# Altium schematic sheet overview.SchDoc
size A4; SheetNumber: 1; SheetTotal: 2
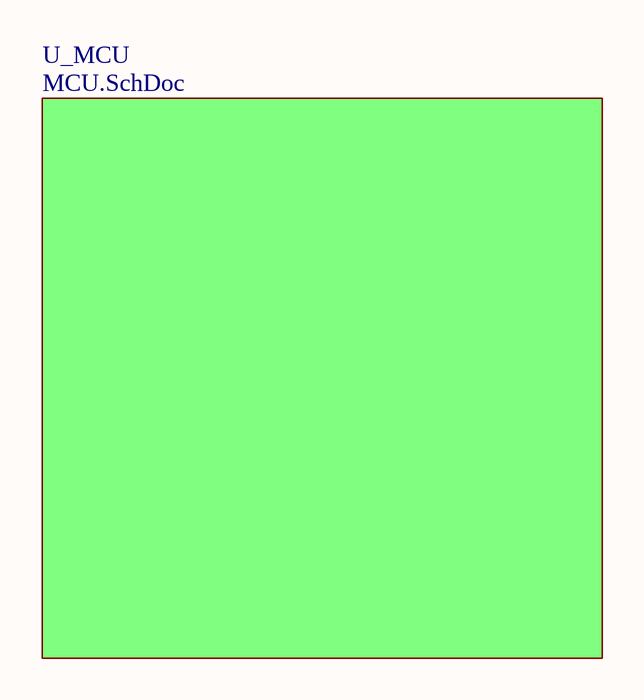
[diagram p0: overview.SchDoc]

## Sub-sheets
U_MCU = MCU.SchDoc: no entries